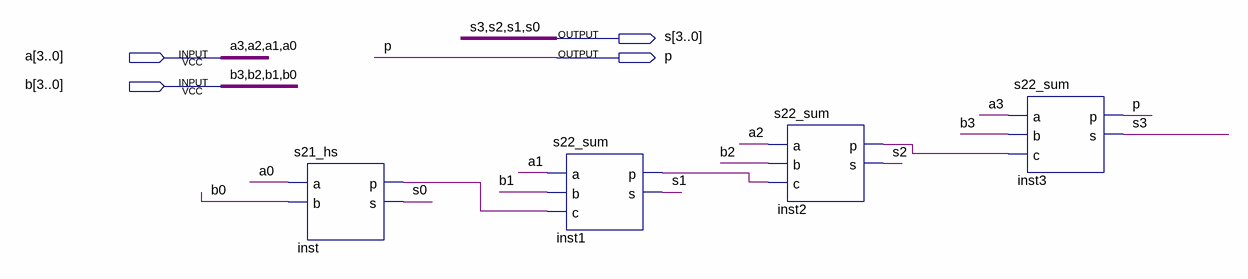
[diagram p0: schematic sheet]
// Quartus schematic s24_4sum.bdf as structural Verilog: 4 symbols, 4 pins
module s24_4sum (
  input  [3:0] a,
  input  [3:0] b,
  output [3:0] s,
  output p
);

  wire inst1_p, inst2_p, inst_p;

  s21_hs inst (.a(a[0]), .b(b[0]), .p(inst_p), .s(s[0]));
  s22_sum inst1 (.a(a[1]), .b(b[1]), .c(inst_p), .p(inst1_p), .s(s[1]));
  s22_sum inst2 (.a(a[2]), .b(b[2]), .c(inst1_p), .p(inst2_p), .s(s[2]));
  s22_sum inst3 (.a(a[3]), .b(b[3]), .c(inst2_p), .p(p), .s(s[3]));
endmodule
